# Altium schematic sheet AFR_bar.SchDoc
size B
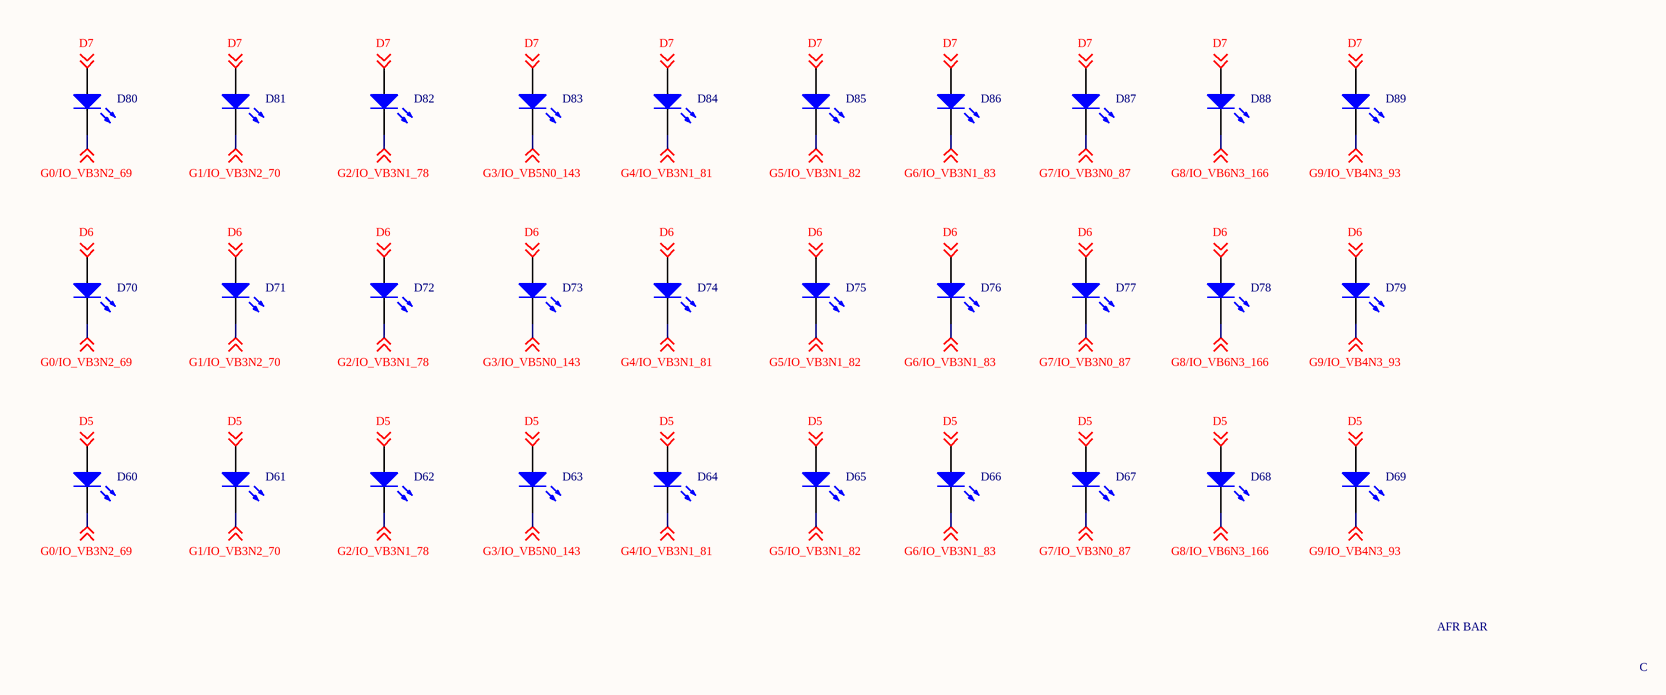
[diagram p0: AFR_bar.SchDoc]

## Parts
D60  (no value)  [DIODE_0603]
D61  (no value)  [DIODE_0603]
D62  (no value)  [DIODE_0603]
D63  (no value)  [DIODE_0603]
D64  (no value)  [DIODE_0603]
D65  (no value)  [DIODE_0603]
D66  (no value)  [DIODE_0603]
D67  (no value)  [DIODE_0603]
D68  (no value)  [DIODE_0603]
D69  (no value)  [DIODE_0603]
D70  (no value)  [DIODE_0603]
D71  (no value)  [DIODE_0603]
D72  (no value)  [DIODE_0603]
D73  (no value)  [DIODE_0603]
D74  (no value)  [DIODE_0603]
D75  (no value)  [DIODE_0603]
D76  (no value)  [DIODE_0603]
D77  (no value)  [DIODE_0603]
D78  (no value)  [DIODE_0603]
D79  (no value)  [DIODE_0603]
D80  (no value)  [DIODE_0603]
D81  (no value)  [DIODE_0603]
D82  (no value)  [DIODE_0603]
D83  (no value)  [DIODE_0603]
D84  (no value)  [DIODE_0603]
D85  (no value)  [DIODE_0603]
D86  (no value)  [DIODE_0603]
D87  (no value)  [DIODE_0603]
D88  (no value)  [DIODE_0603]
D89  (no value)  [DIODE_0603]

## Nets
D5: D60.1(A) D61.1(A) D62.1(A) D63.1(A) D64.1(A) D65.1(A) D66.1(A) D67.1(A) D68.1(A) D69.1(A) ; off-sheet D5
D6: D70.1(A) D71.1(A) D72.1(A) D73.1(A) D74.1(A) D75.1(A) D76.1(A) D77.1(A) D78.1(A) D79.1(A) ; off-sheet D6
D7: D80.1(A) D81.1(A) D82.1(A) D83.1(A) D84.1(A) D85.1(A) D86.1(A) D87.1(A) D88.1(A) D89.1(A) ; off-sheet D7
G0/IO_VB3N2_69: D60.2(K) D70.2(K) D80.2(K) ; off-sheet G0/IO_VB3N2_69
G1/IO_VB3N2_70: D61.2(K) D71.2(K) D81.2(K) ; off-sheet G1/IO_VB3N2_70
G2/IO_VB3N1_78: D62.2(K) D72.2(K) D82.2(K) ; off-sheet G2/IO_VB3N1_78
G3/IO_VB5N0_143: D63.2(K) D73.2(K) D83.2(K) ; off-sheet G3/IO_VB5N0_143
G4/IO_VB3N1_81: D64.2(K) D74.2(K) D84.2(K) ; off-sheet G4/IO_VB3N1_81
G5/IO_VB3N1_82: D65.2(K) D75.2(K) D85.2(K) ; off-sheet G5/IO_VB3N1_82
G6/IO_VB3N1_83: D66.2(K) D76.2(K) D86.2(K) ; off-sheet G6/IO_VB3N1_83
G7/IO_VB3N0_87: D67.2(K) D77.2(K) D87.2(K) ; off-sheet G7/IO_VB3N0_87
G8/IO_VB6N3_166: D68.2(K) D78.2(K) D88.2(K) ; off-sheet G8/IO_VB6N3_166
G9/IO_VB4N3_93: D69.2(K) D79.2(K) D89.2(K) ; off-sheet G9/IO_VB4N3_93

## Notes on the sheet
- AFR BAR
- C

## Library data of the parts
D60-D89 = LED0: Typical INFRARED GaAs LED; Published: 8-Jun-2000; LatestRevisionDate: 08-Jul-2005; LatestRevisionNote: Mech Layer 1 removed.; PackageReference: LED-0; Publisher: Altium Limited; PackageDescription: LED; 2 Leads